# EAGLE schematic AstableMultivibrator-PNP-alt (EAGLE 7.6.0)
Forced quenching improves three-transistor FM tuner Lyle Williams -February 29, 2016 http://edn.com/design/diy/4441531/Forced-quenching-improves-three-transistor-FM-tuner
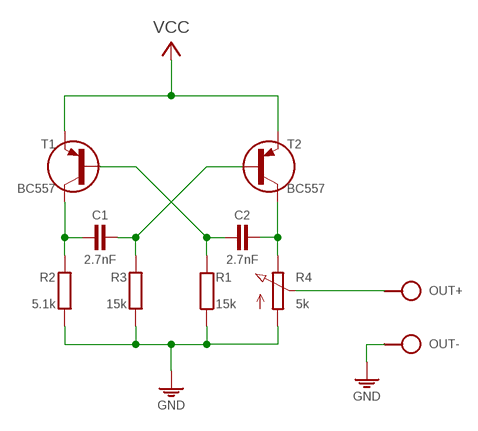
[diagram p0: schematic, sheet 1]

## Parts
C1  2.7nF  C-H075-020X044  [C0750-020X044]
C2  2.7nF  C-H075-020X044  [C0750-020X044]
J1  VCC_GNDPWR-L  [PWR-L]
OUT  SPAD+-+-  [SPAD+-]
R1  15k  R0202/7-V  [0202/7-V]
R2  5.1k  R0202/7-V  [0202/7-V]
R3  15k  R0202/7-V  [0202/7-V]
R4  5k  POT-V  [POT-V]
T1  BC557  BC557CBE  [TO92-CBE]
T2  BC557  BC557CBE  [TO92-CBE]

## Nets
GND: J1.1 OUT.1 R1.1 R2.1 R3.1 R4.A
N$1: C2.2 R4.E T2.C
N$2: C1.1 R2.2 T1.C
N$3: C2.1 R1.2 T1.B
N$4: C1.2 R3.2 T2.B
N$6: OUT.2 R4.S
VCC: J1.2 T1.E T2.E

## Library data of the parts
C1 C2 = c:C-H
J1 = pad:VCC_GND
OUT = pad:SPAD+-
R1-R3 = r:R: RESISTOR, European symbol
R4 = r:POT
T1 T2 = t:BC557

## Net classes
0 default: width 0.61 mm